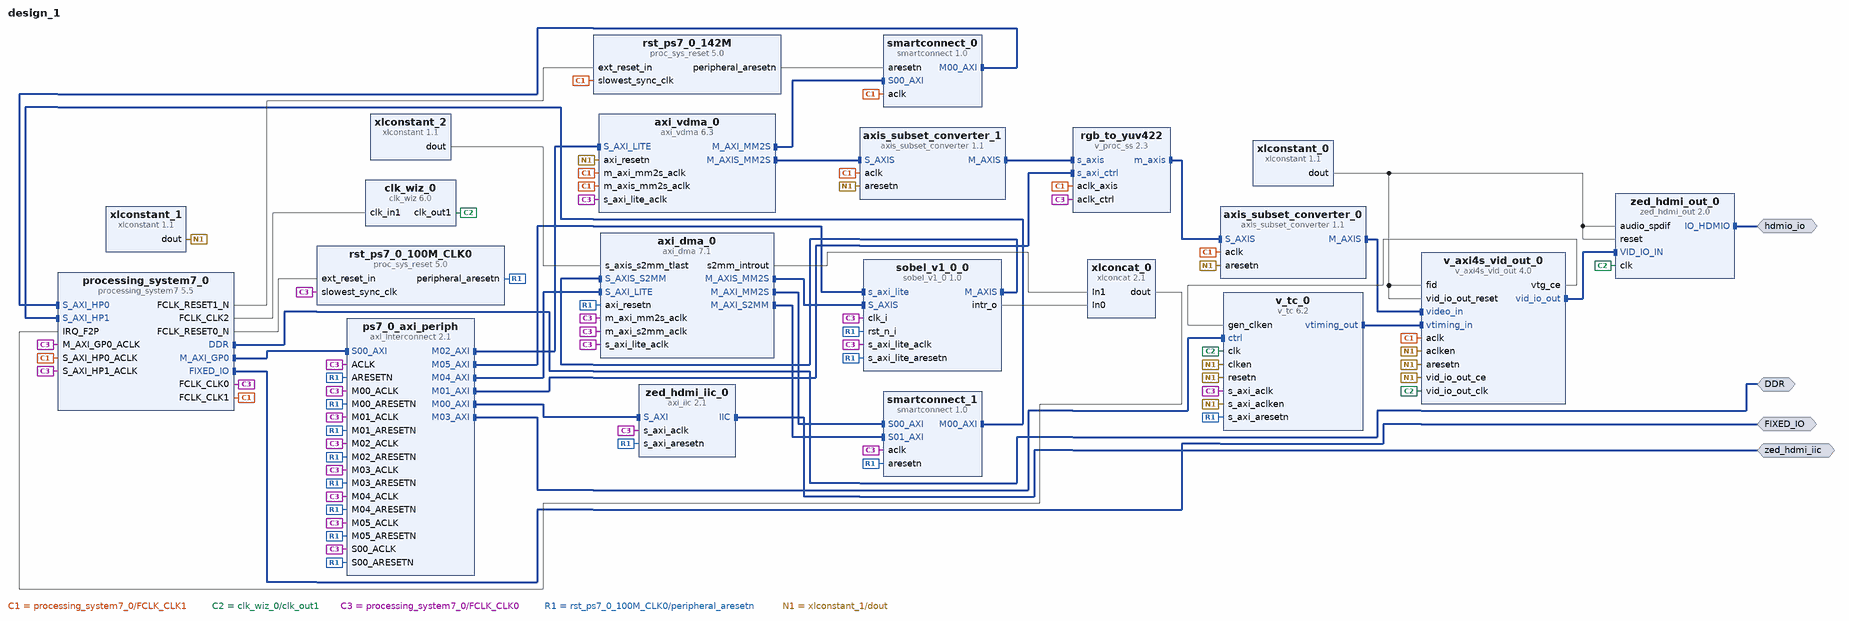
[diagram p0: block diagram of the top level]
# Vivado block design design_1, xc7z020clg484-1, Vivado 2022.1
create_bd_design design_1

create_bd_intf_port -mode Master -vlnv xilinx.com:interface:ddrx_rtl:1.0 DDR
create_bd_intf_port -mode Master -vlnv xilinx.com:display_processing_system7:fixedio_rtl:1.0 FIXED_IO
create_bd_intf_port -mode Master -vlnv avnet.com:interface:avnet_hdmi_rtl:1.0 hdmio_io
create_bd_intf_port -mode Master -vlnv xilinx.com:interface:iic_rtl:1.0 zed_hdmi_iic

create_bd_cell -type ip -vlnv xilinx.com:ip:axi_dma:7.1 axi_dma_0
set_property -dict [list \
  CONFIG.c_include_mm2s_dre 1 \
  CONFIG.c_include_s2mm_dre 1 \
  CONFIG.c_include_sg 0 \
  CONFIG.c_mm2s_burst_size 256 \
  CONFIG.c_s2mm_burst_size 256 \
  CONFIG.c_sg_length_width 26 \
] [get_bd_cells axi_dma_0]
create_bd_cell -type ip -vlnv xilinx.com:ip:axi_vdma:6.3 axi_vdma_0
set_property -dict [list \
  CONFIG.c_include_s2mm 0 \
  CONFIG.c_m_axi_mm2s_data_width 32 \
  CONFIG.c_m_axis_mm2s_tdata_width 32 \
  CONFIG.c_mm2s_linebuffer_depth 512 \
  CONFIG.c_mm2s_max_burst_length 16 \
  CONFIG.c_num_fstores 1 \
] [get_bd_cells axi_vdma_0]
create_bd_cell -type ip -vlnv xilinx.com:ip:axis_subset_converter:1.1 axis_subset_converter_0
set_property -dict [list \
  CONFIG.M_HAS_TKEEP 1 \
  CONFIG.M_HAS_TLAST 1 \
  CONFIG.M_TDATA_NUM_BYTES 2 \
  CONFIG.M_TUSER_WIDTH 1 \
  CONFIG.S_HAS_TKEEP 1 \
  CONFIG.S_HAS_TLAST 1 \
  CONFIG.S_TDATA_NUM_BYTES 3 \
  CONFIG.S_TUSER_WIDTH 1 \
  CONFIG.TDATA_REMAP {tdata[15:0]} \
  CONFIG.TKEEP_REMAP {tkeep[1:0]} \
  CONFIG.TLAST_REMAP {tlast[0]} \
  CONFIG.TUSER_REMAP {tuser[0:0]} \
] [get_bd_cells axis_subset_converter_0]
create_bd_cell -type ip -vlnv xilinx.com:ip:axis_subset_converter:1.1 axis_subset_converter_1
set_property -dict [list \
  CONFIG.M_HAS_TKEEP 1 \
  CONFIG.M_HAS_TLAST 1 \
  CONFIG.M_HAS_TSTRB 1 \
  CONFIG.M_TDATA_NUM_BYTES 3 \
  CONFIG.M_TUSER_WIDTH 1 \
  CONFIG.S_HAS_TKEEP 1 \
  CONFIG.S_HAS_TLAST 1 \
  CONFIG.S_HAS_TSTRB 1 \
  CONFIG.S_TDATA_NUM_BYTES 4 \
  CONFIG.S_TUSER_WIDTH 1 \
  CONFIG.TDATA_REMAP {tdata[23:0]} \
  CONFIG.TDEST_REMAP {1'b0} \
  CONFIG.TID_REMAP {1'b0} \
  CONFIG.TKEEP_REMAP {tkeep[2:0]} \
  CONFIG.TLAST_REMAP {tlast[0]} \
  CONFIG.TSTRB_REMAP {tstrb[2:0]} \
  CONFIG.TUSER_REMAP {tuser[0:0]} \
] [get_bd_cells axis_subset_converter_1]
create_bd_cell -type ip -vlnv xilinx.com:ip:clk_wiz:6.0 clk_wiz_0
set_property -dict [list \
  CONFIG.CLKOUT1_JITTER 217.614 \
  CONFIG.CLKOUT1_PHASE_ERROR 245.344 \
  CONFIG.CLKOUT1_REQUESTED_OUT_FREQ 148.5 \
  CONFIG.MMCM_CLKFBOUT_MULT_F 37.125 \
  CONFIG.MMCM_CLKOUT0_DIVIDE_F 6.250 \
  CONFIG.MMCM_DIVCLK_DIVIDE 4 \
  CONFIG.PRIM_SOURCE No_buffer \
  CONFIG.USE_LOCKED false \
  CONFIG.USE_RESET false \
] [get_bd_cells clk_wiz_0]
create_bd_cell -type ip -vlnv xilinx.com:ip:processing_system7:5.5 processing_system7_0
set_property -dict [list \
  CONFIG.PCW_APU_PERIPHERAL_FREQMHZ 666.666667 \
  CONFIG.PCW_ENET0_PERIPHERAL_ENABLE 0 \
  CONFIG.PCW_EN_CLK1_PORT 1 \
  CONFIG.PCW_EN_CLK2_PORT 1 \
  CONFIG.PCW_EN_RST1_PORT 1 \
  CONFIG.PCW_FCLK_CLK1_BUF TRUE \
  CONFIG.PCW_FCLK_CLK2_BUF TRUE \
  CONFIG.PCW_FPGA0_PERIPHERAL_FREQMHZ 100.000000 \
  CONFIG.PCW_FPGA1_PERIPHERAL_FREQMHZ 170.000000 \
  CONFIG.PCW_FPGA2_PERIPHERAL_FREQMHZ 100.000000 \
  CONFIG.PCW_FPGA_FCLK1_ENABLE 1 \
  CONFIG.PCW_FPGA_FCLK2_ENABLE 1 \
  CONFIG.PCW_GPIO_MIO_GPIO_ENABLE 1 \
  CONFIG.PCW_GPIO_MIO_GPIO_IO MIO \
  CONFIG.PCW_I2C_RESET_ENABLE 1 \
  CONFIG.PCW_IRQ_F2P_INTR 1 \
  CONFIG.PCW_PERIPHERAL_BOARD_PRESET part0 \
  CONFIG.PCW_PRESET_BANK1_VOLTAGE {LVCMOS 1.8V} \
  CONFIG.PCW_QSPI_GRP_SINGLE_SS_ENABLE 1 \
  CONFIG.PCW_QSPI_GRP_SINGLE_SS_IO {MIO 1 .. 6} \
  CONFIG.PCW_QSPI_PERIPHERAL_ENABLE 1 \
  CONFIG.PCW_QSPI_QSPI_IO {MIO 1 .. 6} \
  CONFIG.PCW_SD0_GRP_CD_ENABLE 1 \
  CONFIG.PCW_SD0_GRP_CD_IO {MIO 47} \
  CONFIG.PCW_SD0_GRP_WP_ENABLE 1 \
  CONFIG.PCW_SD0_GRP_WP_IO {MIO 46} \
  CONFIG.PCW_SD0_PERIPHERAL_ENABLE 1 \
  CONFIG.PCW_SD0_SD0_IO {MIO 40 .. 45} \
  CONFIG.PCW_SDIO_PERIPHERAL_FREQMHZ 50 \
  CONFIG.PCW_SINGLE_QSPI_DATA_MODE x4 \
  CONFIG.PCW_UART1_PERIPHERAL_ENABLE 1 \
  CONFIG.PCW_UART1_UART1_IO {MIO 48 .. 49} \
  CONFIG.PCW_UART_PERIPHERAL_FREQMHZ 50 \
  CONFIG.PCW_UIPARAM_DDR_FREQ_MHZ 533.333313 \
  CONFIG.PCW_UIPARAM_DDR_PARTNO {MT41J128M16 HA-15E} \
  CONFIG.PCW_USB0_PERIPHERAL_ENABLE 0 \
  CONFIG.PCW_USB_RESET_ENABLE 1 \
  CONFIG.PCW_USE_FABRIC_INTERRUPT 1 \
  CONFIG.PCW_USE_S_AXI_HP0 1 \
  CONFIG.PCW_USE_S_AXI_HP1 1 \
  CONFIG.preset ZedBoard \
] [get_bd_cells processing_system7_0]
# 501 more settings of processing_system7_0 are not shown: defaults, MIO pin electricals, DDR timing, and values the tool derives
create_bd_cell -type ip -vlnv xilinx.com:ip:axi_interconnect:2.1 ps7_0_axi_periph
set_property -dict {CONFIG.NUM_MI 6} [get_bd_cells ps7_0_axi_periph]
create_bd_cell -type ip -vlnv xilinx.com:ip:v_proc_ss:2.3 rgb_to_yuv422
set_property -dict [list \
  CONFIG.C_AXIMM_DATA_WIDTH 64 \
  CONFIG.C_COLORSPACE_SUPPORT 1 \
  CONFIG.C_ENABLE_DMA false \
  CONFIG.C_ENABLE_INTERLACED false \
  CONFIG.C_MAX_COLS 1920 \
  CONFIG.C_MAX_DATA_WIDTH 8 \
  CONFIG.C_MAX_ROWS 1080 \
  CONFIG.C_SAMPLES_PER_CLK 1 \
  CONFIG.C_TOPOLOGY 1 \
  CONFIG.C_V_CHROMA_TAPS 4 \
] [get_bd_cells rgb_to_yuv422]
create_bd_cell -type ip -vlnv xilinx.com:ip:proc_sys_reset:5.0 rst_ps7_0_100M_CLK0
create_bd_cell -type ip -vlnv xilinx.com:ip:proc_sys_reset:5.0 rst_ps7_0_142M
create_bd_cell -type ip -vlnv xilinx.com:ip:smartconnect:1.0 smartconnect_0
set_property -dict {CONFIG.NUM_SI 1} [get_bd_cells smartconnect_0]
create_bd_cell -type ip -vlnv xilinx.com:ip:smartconnect:1.0 smartconnect_1
set_property -dict {CONFIG.NUM_SI 2} [get_bd_cells smartconnect_1]
create_bd_cell -type ip -vlnv xilinx.com:ip:v_axi4s_vid_out:4.0 v_axi4s_vid_out_0
set_property -dict {CONFIG.C_HAS_ASYNC_CLK 1 CONFIG.C_S_AXIS_VIDEO_FORMAT 0} [get_bd_cells v_axi4s_vid_out_0]
create_bd_cell -type ip -vlnv xilinx.com:ip:v_tc:6.2 v_tc_0
set_property -dict [list \
  CONFIG.HAS_INTC_IF false \
  CONFIG.VIDEO_MODE 1080p \
  CONFIG.active_video_generation true \
  CONFIG.enable_detection false \
  CONFIG.vertical_blank_generation true \
] [get_bd_cells v_tc_0]
create_bd_cell -type ip -vlnv xilinx.com:ip:xlconcat:2.1 xlconcat_0
create_bd_cell -type ip -vlnv xilinx.com:ip:xlconstant:1.1 xlconstant_0
set_property -dict {CONFIG.CONST_VAL 0} [get_bd_cells xlconstant_0]
create_bd_cell -type ip -vlnv xilinx.com:ip:xlconstant:1.1 xlconstant_1
create_bd_cell -type ip -vlnv xilinx.com:ip:xlconstant:1.1 xlconstant_2
set_property -dict {CONFIG.CONST_VAL 0} [get_bd_cells xlconstant_2]
create_bd_cell -type ip -vlnv xilinx.com:ip:axi_iic:2.1 zed_hdmi_iic_0
create_bd_cell -type ip -vlnv avnet:zedboard:zed_hdmi_out:2.0 zed_hdmi_out_0
create_bd_cell -type ip -vlnv user.org:user:sobel_v1_0:1.0 sobel_v1_0_0

# ---- connections ----

connect_bd_intf_net [get_bd_intf_pins axi_dma_0/M_AXIS_MM2S] [get_bd_intf_pins sobel_v1_0_0/S_AXIS]
connect_bd_intf_net [get_bd_intf_pins axi_dma_0/M_AXI_MM2S] [get_bd_intf_pins smartconnect_1/S00_AXI]
connect_bd_intf_net [get_bd_intf_pins axi_dma_0/M_AXI_S2MM] [get_bd_intf_pins smartconnect_1/S01_AXI]
connect_bd_intf_net [get_bd_intf_pins axi_vdma_0/M_AXIS_MM2S] [get_bd_intf_pins axis_subset_converter_1/S_AXIS]
connect_bd_intf_net [get_bd_intf_pins axis_subset_converter_0/M_AXIS] [get_bd_intf_pins v_axi4s_vid_out_0/video_in]
connect_bd_intf_net [get_bd_intf_pins axis_subset_converter_1/M_AXIS] [get_bd_intf_pins rgb_to_yuv422/s_axis]
connect_bd_intf_net -intf_net hier_1_M00_AXI [get_bd_intf_pins axi_vdma_0/M_AXI_MM2S] [get_bd_intf_pins smartconnect_0/S00_AXI]
connect_bd_intf_net -intf_net hier_1_hdmio_io [get_bd_intf_ports hdmio_io] [get_bd_intf_pins zed_hdmi_out_0/IO_HDMIO]
connect_bd_intf_net [get_bd_intf_ports DDR] [get_bd_intf_pins processing_system7_0/DDR]
connect_bd_intf_net [get_bd_intf_ports FIXED_IO] [get_bd_intf_pins processing_system7_0/FIXED_IO]
connect_bd_intf_net [get_bd_intf_pins processing_system7_0/M_AXI_GP0] [get_bd_intf_pins ps7_0_axi_periph/S00_AXI]
connect_bd_intf_net [get_bd_intf_pins ps7_0_axi_periph/M00_AXI] [get_bd_intf_pins zed_hdmi_iic_0/S_AXI]
connect_bd_intf_net [get_bd_intf_pins ps7_0_axi_periph/M01_AXI] [get_bd_intf_pins rgb_to_yuv422/s_axi_ctrl]
connect_bd_intf_net [get_bd_intf_pins axi_vdma_0/S_AXI_LITE] [get_bd_intf_pins ps7_0_axi_periph/M02_AXI]
connect_bd_intf_net [get_bd_intf_pins ps7_0_axi_periph/M03_AXI] [get_bd_intf_pins v_tc_0/ctrl]
connect_bd_intf_net [get_bd_intf_pins axi_dma_0/S_AXI_LITE] [get_bd_intf_pins ps7_0_axi_periph/M04_AXI]
connect_bd_intf_net [get_bd_intf_pins ps7_0_axi_periph/M05_AXI] [get_bd_intf_pins sobel_v1_0_0/s_axi_lite]
connect_bd_intf_net [get_bd_intf_pins axis_subset_converter_0/S_AXIS] [get_bd_intf_pins rgb_to_yuv422/m_axis]
connect_bd_intf_net [get_bd_intf_pins processing_system7_0/S_AXI_HP0] [get_bd_intf_pins smartconnect_0/M00_AXI]
connect_bd_intf_net [get_bd_intf_pins processing_system7_0/S_AXI_HP1] [get_bd_intf_pins smartconnect_1/M00_AXI]
connect_bd_intf_net [get_bd_intf_pins axi_dma_0/S_AXIS_S2MM] [get_bd_intf_pins sobel_v1_0_0/M_AXIS]
connect_bd_intf_net [get_bd_intf_pins v_axi4s_vid_out_0/vid_io_out] [get_bd_intf_pins zed_hdmi_out_0/VID_IO_IN]
connect_bd_intf_net [get_bd_intf_pins v_axi4s_vid_out_0/vtiming_in] [get_bd_intf_pins v_tc_0/vtiming_out]
connect_bd_intf_net [get_bd_intf_ports zed_hdmi_iic] [get_bd_intf_pins zed_hdmi_iic_0/IIC]
connect_bd_net [get_bd_pins xlconstant_0/dout] \
  [get_bd_pins v_axi4s_vid_out_0/fid] [get_bd_pins v_axi4s_vid_out_0/vid_io_out_reset] \
  [get_bd_pins zed_hdmi_out_0/audio_spdif] [get_bd_pins zed_hdmi_out_0/reset]
connect_bd_net -net axi4s_clk_1 [get_bd_pins processing_system7_0/FCLK_CLK1] \
  [get_bd_pins axi_vdma_0/m_axi_mm2s_aclk] [get_bd_pins axi_vdma_0/m_axis_mm2s_aclk] \
  [get_bd_pins axis_subset_converter_0/aclk] [get_bd_pins axis_subset_converter_1/aclk] \
  [get_bd_pins processing_system7_0/S_AXI_HP0_ACLK] [get_bd_pins rgb_to_yuv422/aclk_axis] \
  [get_bd_pins rst_ps7_0_142M/slowest_sync_clk] [get_bd_pins smartconnect_0/aclk] [get_bd_pins v_axi4s_vid_out_0/aclk]
connect_bd_net [get_bd_pins axi_dma_0/s2mm_introut] [get_bd_pins xlconcat_0/In1]
connect_bd_net -net hdmio_clk_1 [get_bd_pins clk_wiz_0/clk_out1] \
  [get_bd_pins v_axi4s_vid_out_0/vid_io_out_clk] [get_bd_pins v_tc_0/clk] [get_bd_pins zed_hdmi_out_0/clk]
connect_bd_net [get_bd_pins processing_system7_0/FCLK_CLK0] \
  [get_bd_pins axi_dma_0/m_axi_mm2s_aclk] [get_bd_pins axi_dma_0/m_axi_s2mm_aclk] [get_bd_pins axi_dma_0/s_axi_lite_aclk] \
  [get_bd_pins axi_vdma_0/s_axi_lite_aclk] [get_bd_pins processing_system7_0/M_AXI_GP0_ACLK] \
  [get_bd_pins processing_system7_0/S_AXI_HP1_ACLK] [get_bd_pins ps7_0_axi_periph/ACLK] \
  [get_bd_pins ps7_0_axi_periph/M00_ACLK] [get_bd_pins ps7_0_axi_periph/M01_ACLK] [get_bd_pins ps7_0_axi_periph/M02_ACLK] \
  [get_bd_pins ps7_0_axi_periph/M03_ACLK] [get_bd_pins ps7_0_axi_periph/M04_ACLK] [get_bd_pins ps7_0_axi_periph/M05_ACLK] \
  [get_bd_pins ps7_0_axi_periph/S00_ACLK] [get_bd_pins rgb_to_yuv422/aclk_ctrl] \
  [get_bd_pins rst_ps7_0_100M_CLK0/slowest_sync_clk] [get_bd_pins smartconnect_1/aclk] [get_bd_pins v_tc_0/s_axi_aclk] \
  [get_bd_pins zed_hdmi_iic_0/s_axi_aclk] [get_bd_pins sobel_v1_0_0/clk_i] [get_bd_pins sobel_v1_0_0/s_axi_lite_aclk]
connect_bd_net [get_bd_pins processing_system7_0/FCLK_CLK2] [get_bd_pins clk_wiz_0/clk_in1]
connect_bd_net [get_bd_pins processing_system7_0/FCLK_RESET0_N] [get_bd_pins rst_ps7_0_100M_CLK0/ext_reset_in]
connect_bd_net [get_bd_pins processing_system7_0/FCLK_RESET1_N] [get_bd_pins rst_ps7_0_142M/ext_reset_in]
connect_bd_net [get_bd_pins rst_ps7_0_142M/peripheral_aresetn] [get_bd_pins smartconnect_0/aresetn]
connect_bd_net -net rst_ps7_0_76M_peripheral_aresetn [get_bd_pins rst_ps7_0_100M_CLK0/peripheral_aresetn] \
  [get_bd_pins axi_dma_0/axi_resetn] [get_bd_pins ps7_0_axi_periph/ARESETN] [get_bd_pins ps7_0_axi_periph/M00_ARESETN] \
  [get_bd_pins ps7_0_axi_periph/M01_ARESETN] [get_bd_pins ps7_0_axi_periph/M02_ARESETN] \
  [get_bd_pins ps7_0_axi_periph/M03_ARESETN] [get_bd_pins ps7_0_axi_periph/M04_ARESETN] \
  [get_bd_pins ps7_0_axi_periph/M05_ARESETN] [get_bd_pins ps7_0_axi_periph/S00_ARESETN] [get_bd_pins smartconnect_1/aresetn] \
  [get_bd_pins v_tc_0/s_axi_aresetn] [get_bd_pins zed_hdmi_iic_0/s_axi_aresetn] [get_bd_pins sobel_v1_0_0/rst_n_i] \
  [get_bd_pins sobel_v1_0_0/s_axi_lite_aresetn]
connect_bd_net [get_bd_pins sobel_v1_0_0/intr_o] [get_bd_pins xlconcat_0/In0]
connect_bd_net [get_bd_pins v_axi4s_vid_out_0/vtg_ce] [get_bd_pins v_tc_0/gen_clken]
connect_bd_net [get_bd_pins xlconcat_0/dout] [get_bd_pins processing_system7_0/IRQ_F2P]
connect_bd_net [get_bd_pins xlconstant_1/dout] \
  [get_bd_pins axi_vdma_0/axi_resetn] [get_bd_pins axis_subset_converter_0/aresetn] \
  [get_bd_pins axis_subset_converter_1/aresetn] [get_bd_pins v_axi4s_vid_out_0/aclken] \
  [get_bd_pins v_axi4s_vid_out_0/aresetn] [get_bd_pins v_axi4s_vid_out_0/vid_io_out_ce] [get_bd_pins v_tc_0/clken] \
  [get_bd_pins v_tc_0/resetn] [get_bd_pins v_tc_0/s_axi_aclken]
connect_bd_net [get_bd_pins xlconstant_2/dout] [get_bd_pins axi_dma_0/s_axis_s2mm_tlast]

# ---- address map ----
assign_bd_address -offset 0x00000000 -range 512M -target_address_space [get_bd_addr_spaces axi_dma_0/Data_MM2S] [get_bd_addr_segs processing_system7_0/S_AXI_HP1/HP1_DDR_LOWOCM]
assign_bd_address -offset 0x00000000 -range 512M -target_address_space [get_bd_addr_spaces axi_dma_0/Data_S2MM] [get_bd_addr_segs processing_system7_0/S_AXI_HP1/HP1_DDR_LOWOCM]
assign_bd_address -offset 0x00000000 -range 512M -target_address_space [get_bd_addr_spaces axi_vdma_0/Data_MM2S] [get_bd_addr_segs processing_system7_0/S_AXI_HP0/HP0_DDR_LOWOCM]
assign_bd_address -offset 0x40000000 -range 4K -target_address_space [get_bd_addr_spaces processing_system7_0/Data] [get_bd_addr_segs sobel_v1_0_0/s_axi_lite/reg0]
assign_bd_address -offset 0x40400000 -range 64K -target_address_space [get_bd_addr_spaces processing_system7_0/Data] [get_bd_addr_segs axi_dma_0/S_AXI_LITE/Reg]
assign_bd_address -offset 0x41600000 -range 64K -target_address_space [get_bd_addr_spaces processing_system7_0/Data] [get_bd_addr_segs zed_hdmi_iic_0/S_AXI/Reg]
assign_bd_address -offset 0x43000000 -range 64K -target_address_space [get_bd_addr_spaces processing_system7_0/Data] [get_bd_addr_segs axi_vdma_0/S_AXI_LITE/Reg]
assign_bd_address -offset 0x43C00000 -range 512K -target_address_space [get_bd_addr_spaces processing_system7_0/Data] [get_bd_addr_segs rgb_to_yuv422/s_axi_ctrl/Reg]
assign_bd_address -offset 0x43C80000 -range 64K -target_address_space [get_bd_addr_spaces processing_system7_0/Data] [get_bd_addr_segs v_tc_0/ctrl/Reg]

validate_bd_design
save_bd_design
